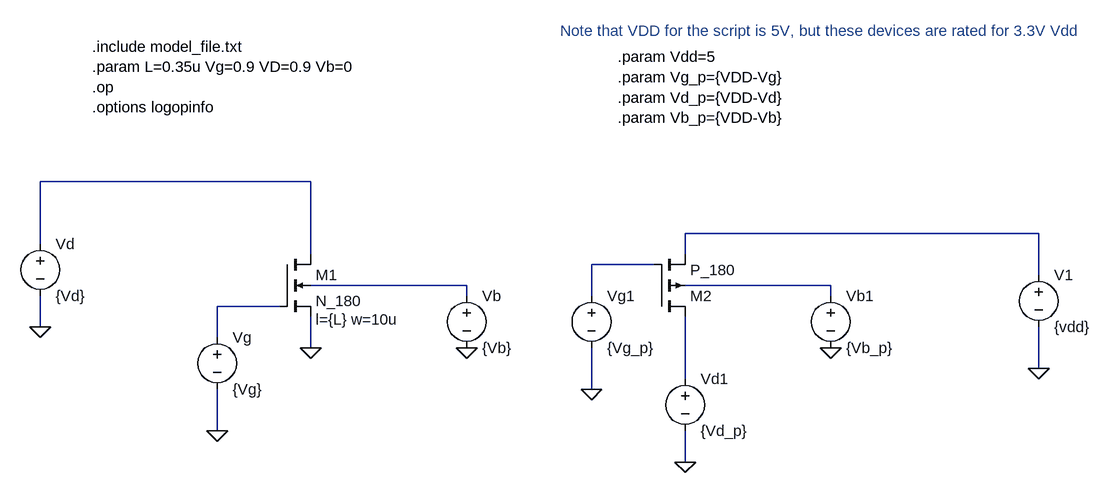
[diagram p0: schematic nmos_char.asc]
nmos_char.asc, the LTspice schematic file:
Version 4.1
SHEET 1 1348 680
WIRE 96 -112 -320 -112
WIRE 1216 -32 672 -32
WIRE -320 -16 -320 -112
WIRE 96 0 96 -112
WIRE 672 0 672 -32
WIRE 624 16 528 16
WIRE 1216 32 1216 -32
WIRE 336 48 96 48
WIRE 896 48 672 48
WIRE 336 64 336 48
WIRE 528 64 528 16
WIRE 896 64 896 48
WIRE 48 80 -48 80
WIRE -320 112 -320 64
WIRE -48 128 -48 80
WIRE 96 144 96 96
WIRE 1216 176 1216 112
WIRE 672 192 672 96
WIRE 528 208 528 144
WIRE -48 272 -48 208
WIRE 672 320 672 272
FLAG 96 144 0
FLAG -48 272 0
FLAG -320 112 0
FLAG 336 144 0
FLAG 896 144 0
FLAG 672 320 0
FLAG 528 208 0
FLAG 1216 176 0
SYMBOL nmos4 48 0 R0
WINDOW 123 56 100 Left 2
SYMATTR Value2 l={L} w=10u
SYMATTR InstName M1
SYMATTR Value N_180
SYMBOL voltage -320 -32 R0
SYMATTR InstName Vd
SYMATTR Value {Vd}
SYMBOL voltage -48 112 R0
SYMATTR InstName Vg
SYMATTR Value {Vg}
SYMBOL voltage 336 48 R0
SYMATTR InstName Vb
SYMATTR Value {Vb}
SYMBOL pmos4 624 96 M180
SYMATTR InstName M2
SYMATTR Value P_180
SYMATTR Value2 l={L} w=10u
SYMBOL voltage 896 48 R0
SYMATTR InstName Vb1
SYMATTR Value {Vb_p}
SYMBOL voltage 672 176 R0
SYMATTR InstName Vd1
SYMATTR Value {Vd_p}
SYMBOL voltage 528 48 R0
SYMATTR InstName Vg1
SYMATTR Value {Vg_p}
SYMBOL voltage 1216 16 R0
SYMATTR InstName V1
SYMATTR Value {vdd}
TEXT -240 -320 Left 2 !.include model_file.txt\n.param L=0.35u Vg=0.9 VD=0.9 Vb=0\n.op\n.options logopinfo
TEXT 480 -344 Left 2 ;Note that VDD for the script is 5V, but these devices are rated for 3.3V Vdd
TEXT 568 -304 Left 2 !.param Vdd=5\n.param Vg_p={VDD-Vg}\n.param Vd_p={VDD-Vd}\n.param Vb_p={VDD-Vb}

The netlist it stands for:
* nmos_char.asc
M1 N001 N006 0 N004 N_180 l={L} w=10u
Vd N001 0 {Vd}
Vg N006 0 {Vg}
Vb N004 0 {Vb}
M2 N007 N003 N002 N005 P_180 l={L} w=10u
Vb1 N005 0 {Vb_p}
Vd1 N007 0 {Vd_p}
Vg1 N003 0 {Vg_p}
V1 N002 0 {vdd}
.model NMOS NMOS
.model PMOS PMOS
.lib standard.mos
.include model_file.txt
.param L=0.35u Vg=0.9 VD=0.9 Vb=0
.op
.options logopinfo
* Note that VDD for the script is 5V, but these devices are rated for 3.3V Vdd
.param Vdd=5
.param Vg_p={VDD-Vg}
.param Vd_p={VDD-Vd}
.param Vb_p={VDD-Vb}
.backanno
.end